# Altium schematic sheet audio.schdoc
size A3
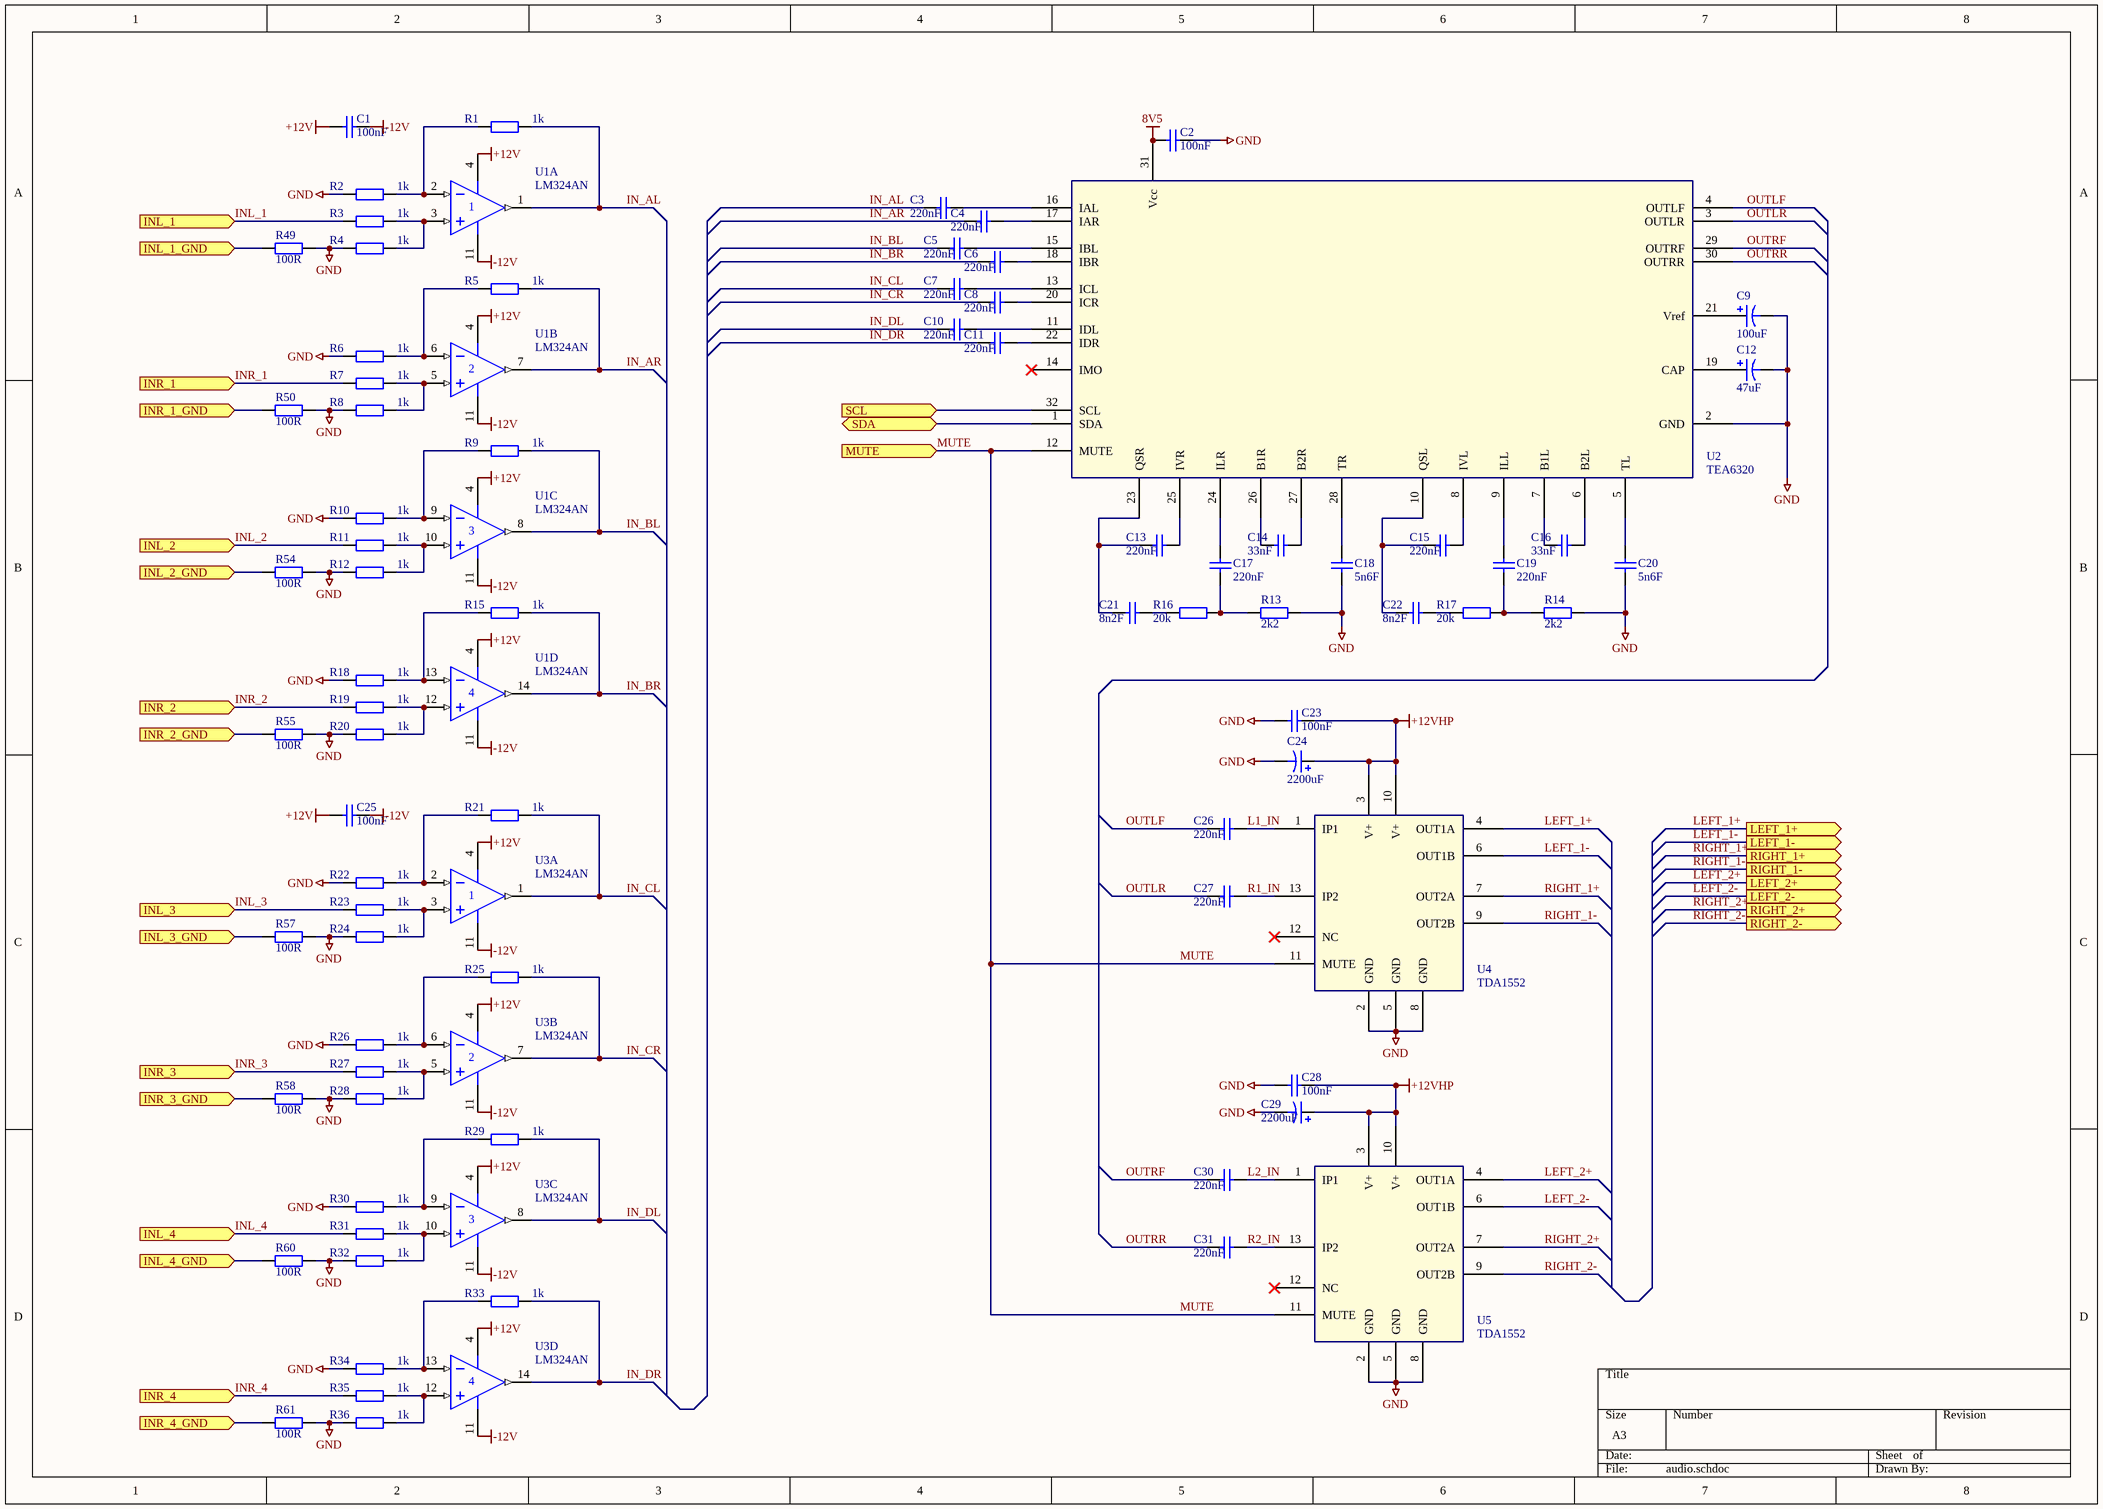
[diagram p0: audio.schdoc]

## Parts
C1  100nF  [CAP (3D) - 0603]
C2  100nF  [CAP (3D) - 0603]
C3  220nF  [CAP (3D) - 0603]
C4  220nF  [CAP (3D) - 0603]
C5  220nF  [CAP (3D) - 0603]
C6  220nF  [CAP (3D) - 0603]
C7  220nF  [CAP (3D) - 0603]
C8  220nF  [CAP (3D) - 0603]
C9  100uF  [CAPPR5-5x5]
C10  220nF  [CAP (3D) - 0603]
C11  220nF  [CAP (3D) - 0603]
C12  47uF  [CAPPR5-5x5]
C13  220nF  [CAP (3D) - 0603]
C14  33nF  [CAP (3D) - 0603]
C15  220nF  [CAP (3D) - 0603]
C16  33nF  [CAP (3D) - 0603]
C17  220nF  [CAP (3D) - 0603]
C18  5n6F  [CAP (3D) - 0603]
C19  220nF  [CAP (3D) - 0603]
C20  5n6F  [CAP (3D) - 0603]
C21  8n2F  [CAP (3D) - 0603]
C22  8n2F  [CAP (3D) - 0603]
C23  100nF  [CAP (3D) - 0603]
C24  2200uF  [CAPPR7.5-16x35]
C25  100nF  [CAP (3D) - 0603]
C26  220nF  [CAP (3D) - 0603]
C27  220nF  [CAP (3D) - 0603]
C28  100nF  [CAP (3D) - 0603]
C29  2200uF  [CAPPR7.5-16x35]
C30  220nF  [CAP (3D) - 0603]
C31  220nF  [CAP (3D) - 0603]
R1  1k  [RES (3D) - 0603]
R2  1k  [RES (3D) - 0603]
R3  1k  [RES (3D) - 0603]
R4  1k  [RES (3D) - 0603]
R5  1k  [RES (3D) - 0603]
R6  1k  [RES (3D) - 0603]
R7  1k  [RES (3D) - 0603]
R8  1k  [RES (3D) - 0603]
R9  1k  [RES (3D) - 0603]
R10  1k  [RES (3D) - 0603]
R11  1k  [RES (3D) - 0603]
R12  1k  [RES (3D) - 0603]
R13  2k2  [RES (3D) - 0603]
R14  2k2  [RES (3D) - 0603]
R15  1k  [RES (3D) - 0603]
R16  20k  [RES (3D) - 0603]
R17  20k  [RES (3D) - 0603]
R18  1k  [RES (3D) - 0603]
R19  1k  [RES (3D) - 0603]
R20  1k  [RES (3D) - 0603]
R21  1k  [RES (3D) - 0603]
R22  1k  [RES (3D) - 0603]
R23  1k  [RES (3D) - 0603]
R24  1k  [RES (3D) - 0603]
R25  1k  [RES (3D) - 0603]
R26  1k  [RES (3D) - 0603]
R27  1k  [RES (3D) - 0603]
R28  1k  [RES (3D) - 0603]
R29  1k  [RES (3D) - 0603]
R30  1k  [RES (3D) - 0603]
R31  1k  [RES (3D) - 0603]
R32  1k  [RES (3D) - 0603]
R33  1k  [RES (3D) - 0603]
R34  1k  [RES (3D) - 0603]
R35  1k  [RES (3D) - 0603]
R36  1k  [RES (3D) - 0603]
R49  100R  [RES (3D) - 0603]
R50  100R  [RES (3D) - 0603]
R54  100R  [RES (3D) - 0603]
R55  100R  [RES (3D) - 0603]
R57  100R  [RES (3D) - 0603]
R58  100R  [RES (3D) - 0603]
R60  100R  [RES (3D) - 0603]
R61  100R  [RES (3D) - 0603]
U1  LM324AN  [N014]  (parts A,B,C,D of 4)
U2  TEA6320  [SOIC127P1047-32L]
U3  LM324AN  [N014]  (parts A,B,C,D of 4)
U4  TDA1552  [DBS13P]
U5  TDA1552  [DBS13P]

## Ports
INL_1 (in), INL_1_GND (in), INL_2 (in), INL_2_GND (in), INL_3 (in), INL_3_GND (in), INL_4 (in), INL_4_GND (in), INR_1 (in), INR_1_GND (in), INR_2 (in), INR_2_GND (in), INR_3 (in), INR_3_GND (in), INR_4 (in), INR_4_GND (in), LEFT_1+ (out), LEFT_1- (out), LEFT_2+ (out), LEFT_2- (out), MUTE (in), RIGHT_1+ (out), RIGHT_1- (out), RIGHT_2+ (out), RIGHT_2- (out), SCL (in), SDA (bidir)

## Nets
8V5: C2.1 U2.31(Vcc)
+12V: C1.1 C25.1 U1.4(V+) U3.4(V+)
+12VHP: C23.2 C24.1 C28.2 C29.1 U4.3(V+) U4.10(V+) U5.3(V+) U5.10(V+)
-12V: C1.2 C25.2 U1.11(V-) U3.11(V-)
GND: C2.2 C9.2 C12.2 C18.2 C20.2 C23.1 C24.2 C28.1 C29.2 R2.1 R4.1 R6.1 R8.1 R10.1 R12.1 R13.2 R14.2 R18.1 R20.1 R22.1 R24.1 R26.1 R28.1 R30.1 R32.1 R34.1 R36.1 R49.2 R50.2 R54.2 R55.2 R57.2 R58.2 R60.2 R61.2 U2.2(GND) U4.2(GND) U4.5(GND) U4.8(GND) U5.2(GND) U5.5(GND) U5.8(GND)
IN_AL: C3.1 R1.2 U1.1(OUT)
IN_AR: C4.1 R5.2 U1.7(OUT)
IN_BL: C5.1 R9.2 U1.8(OUT)
IN_BR: C6.1 R15.2 U1.14(OUT)
IN_CL: C7.1 R21.2 U3.1(OUT)
IN_CR: C8.1 R25.2 U3.7(OUT)
IN_DL: C10.1 R29.2 U3.8(OUT)
IN_DR: C11.1 R33.2 U3.14(OUT)
INL_1: R3.1 ; port INL_1
INL_1_GND: R49.1 ; port INL_1_GND
INL_2: R11.1 ; port INL_2
INL_2_GND: R54.1 ; port INL_2_GND
INL_3: R23.1 ; port INL_3
INL_3_GND: R57.1 ; port INL_3_GND
INL_4: R31.1 ; port INL_4
INL_4_GND: R60.1 ; port INL_4_GND
INR_1: R7.1 ; port INR_1
INR_1_GND: R50.1 ; port INR_1_GND
INR_2: R19.1 ; port INR_2
INR_2_GND: R55.1 ; port INR_2_GND
INR_3: R27.1 ; port INR_3
INR_3_GND: R58.1 ; port INR_3_GND
INR_4: R35.1 ; port INR_4
INR_4_GND: R61.1 ; port INR_4_GND
L1_IN: C26.2 U4.1(IP1)
L2_IN: C30.2 U5.1(IP1)
LEFT_1+: U4.4(OUT1A) ; port LEFT_1+
LEFT_1-: U4.6(OUT1B) ; port LEFT_1-
LEFT_2+: U5.4(OUT1A) ; port LEFT_2+
LEFT_2-: U5.6(OUT1B) ; port LEFT_2-
MUTE: U2.12(MUTE) U4.11(MUTE) U5.11(MUTE) ; port MUTE
OUTLF: C26.1 U2.4(OUTLF)
OUTLR: C27.1 U2.3(OUTLR)
OUTRF: C30.1 U2.29(OUTRF)
OUTRR: C31.1 U2.30(OUTRR)
R1_IN: C27.2 U4.13(IP2)
R2_IN: C31.2 U5.13(IP2)
RIGHT_1+: U4.7(OUT2A) ; port RIGHT_1+
RIGHT_1-: U4.9(OUT2B) ; port RIGHT_1-
RIGHT_2+: U5.7(OUT2A) ; port RIGHT_2+
RIGHT_2-: U5.9(OUT2B) ; port RIGHT_2-
SCL: U2.32(SCL) ; port SCL
SDA: U2.1(SDA) ; port SDA
NetC3_2: C3.2 U2.16(IAL)
NetC4_2: C4.2 U2.17(IAR)
NetC5_2: C5.2 U2.15(IBL)
NetC6_2: C6.2 U2.18(IBR)
NetC7_2: C7.2 U2.13(ICL)
NetC8_2: C8.2 U2.20(ICR)
NetC9_1: C9.1 U2.21(Vref)
NetC10_2: C10.2 U2.11(IDL)
NetC11_2: C11.2 U2.22(IDR)
NetC12_1: C12.1 U2.19(CAP)
NetC13_1: C13.1 C21.1 U2.23(QSR)
NetC13_2: C13.2 U2.25(IVR)
NetC14_1: C14.1 U2.26(B1R)
NetC14_2: C14.2 U2.27(B2R)
NetC15_1: C15.1 C22.1 U2.10(QSL)
NetC15_2: C15.2 U2.8(IVL)
NetC16_1: C16.1 U2.7(B1L)
NetC16_2: C16.2 U2.6(B2L)
NetC17_1: C17.1 U2.24(ILR)
NetC17_2: C17.2 R13.1 R16.1
NetC18_1: C18.1 U2.28(TR)
NetC19_1: C19.1 U2.9(ILL)
NetC19_2: C19.2 R14.1 R17.1
NetC20_1: C20.1 U2.5(TL)
NetC21_2: C21.2 R16.2
NetC22_2: C22.2 R17.2
NetR1_1: R1.1 R2.2 U1.2(IN-)
NetR3_2: R3.2 R4.2 U1.3(IN+)
NetR5_1: R5.1 R6.2 U1.6(IN-)
NetR7_2: R7.2 R8.2 U1.5(IN+)
NetR9_1: R9.1 R10.2 U1.9(IN-)
NetR11_2: R11.2 R12.2 U1.10(IN+)
NetR15_1: R15.1 R18.2 U1.13(IN-)
NetR19_2: R19.2 R20.2 U1.12(IN+)
NetR21_1: R21.1 R22.2 U3.2(IN-)
NetR23_2: R23.2 R24.2 U3.3(IN+)
NetR25_1: R25.1 R26.2 U3.6(IN-)
NetR27_2: R27.2 R28.2 U3.5(IN+)
NetR29_1: R29.1 R30.2 U3.9(IN-)
NetR31_2: R31.2 R32.2 U3.10(IN+)
NetR33_1: R33.1 R34.2 U3.13(IN-)
NetR35_2: R35.2 R36.2 U3.12(IN+)

Not connected (* = marked no-connect by the designer): U2 14(IMO)*; U4 12(NC)*; U5 12(NC)*

## Library data of the parts
C1 C2 C23 C25 C28 = Cap: Capacitor; Manufacturer: YAEGO; Manufacturer Part No.: CC0603ZRY5V9BB104; Value: 100nF; Mouser Part no.: 603-C0603ZRY5V9BB104; Web link: http://au.mouser.com/ProductDetail/Yageo/CC0603ZRY5V9BB104/?qs=AgBp2OyFlx%252bk1xe0tOfw5lSGBXIDidlPHbEeepmuVSw%3d; Supplier 1: Mouser; Supplier Part Number 1: 603-C0603ZRY5V9BB104; Supplier 2: Digi-Key; Supplier Part Number 2: 311-1343-2-ND
C3-C8 C10 C11 C13 C15 C17 C19 C26 C27 C30 C31 = Cap: Capacitor; Manufacturer: YAGEO; Manufacturer Part No.: CC0603KRX7R6BB224; Value: 220nF; Mouser Part no.: 603-CC603KRX7R6BB224; Web link: http://au.mouser.com/ProductDetail/Yageo/CC0603KRX7R6BB224/?qs=AgBp2OyFlx832aJNQIgpgiHcXe6SP9wJA8622nI5Qdc%3d; Supplier 1: Mouser; Supplier 2: Digi-Key; Supplier Part Number 1: 810-C1608X7R1E224K; Supplier Part Number 2: 445-5191-1-ND
C9 = Cap Pol1: Polarized Capacitor (Radial); Manufacturer: EPCOS; Manufacturer Part No.: B41828A7107M7; Value: 100uF; Mouser Part No.: 871-B41828A7107M7; Web Link: http://au.mouser.com/ProductDetail/EPCOS/B41828A7107M7/?qs=nVvxX1UUhUykfM7qFE3BRbEQLHdHrVYrVo8dT3SN8Ro%3d; Supplier 1: Mouser; Supplier Part Number 1: 667-EEU-FR1E101; Supplier 2: Digi-Key; Supplier Part Number 2: P5152-ND
C12 = Cap Pol1: Polarized Capacitor (Radial); Manufacturer: EPCOS; Manufacturer Part No.: B41821A7476M000; Value: 47uF; Mouser Part No.: 871-B41821A7476M000; Web Link: http://au.mouser.com/ProductDetail/EPCOS/B41821A7476M000/?qs=DFkWJ3l%252bHdIv7z5oK21FR7vsdrlTw8IhmVcyMZVp3lA%3d; Supplier 1: Mouser; Supplier Part Number 1: 667-EEU-FR1E470; Supplier 2: Digi-Key; Supplier Part Number 2: P15360CT-ND
C14 C16 = Cap: Capacitor; Manufacturer: VISHAY; Manufacturer Part No.: VJ0603Y333KXACW1BC; Value: 33nF; Mouser Part No.: 77-VJ0603Y333KXACBC; Web Link: http://au.mouser.com/ProductDetail/Vishay-Vitramon/VJ0603Y333KXACW1BC/?qs=luzi6J3HciVz2jbLrp0fISmEIlUx13SmksE8B%2fo8iFo%3d; Supplier 1: Mouser; Supplier Part Number 1: 810-CGJ3E2X7R1C333K; Supplier 2: Digi-Key; Supplier Part Number 2: 445-5093-1-ND
C18 C20 = Cap: Capacitor; Manufacturer: YAEGO; Manufacturer Part No.: CC0603KRX7R9BB562; Value: 5n6F; Mouser Part No.: 603-CC603KRX7R9BB562; Web Link: http://au.mouser.com/ProductDetail/Yageo/CC0603KRX7R9BB562/?qs=AgBp2OyFlx%2fpnRyz2d1BOV0w2oSYtKHWEBmm9y5urok%3d; Supplier 1: Mouser; Supplier Part Number 1: 77-VJ0603Y562KXAPBC; Supplier 2: Digi-Key; Supplier Part Number 2: 445-2666-1-ND
C21 C22 = Cap: Capacitor; Manufacturer: VISHAY; Manufacturer Part No.: VJ0603Y822KXACW1BC; Value: 8n2F; Mouser Part No.: 77-VJ0603Y822KXACBC; Web Link: http://au.mouser.com/ProductDetail/Vishay-Vitramon/VJ0603Y822KXACW1BC/?qs=ZwrkFVw2o8%2ft%252b373yGtNl93PhR3QyA%252bD6uaH33kGuhU%3d; Supplier 1: Mouser; Supplier 2: Digi-Key; Supplier Part Number 1: 81-GRM18R71E822KA01D; Supplier Part Number 2: 445-2668-6-ND
C24 C29 = Cap Pol1: Polarized Capacitor (Radial); Manufacturer: Lelon; Manufacturer Part No.: RGA222M1EBK-1625P; Value: 2200uF; Mouser Part No.: 140-RGA222M1EBK1625P; Web Link: http://au.mouser.com/ProductDetail/Lelon/RGA222M1EBK-1625P/?qs=LVGG2qFPDbHSw2xJTgLljXX%252bpY7%2f7oyC%252beiZpKBfNsE%3d; Supplier 1: Mouser; Supplier 2: Digi-Key; Supplier Part Number 1: 80-ESK228M025AL4AA; Supplier Part Number 2: 399-6110-ND
R1-R12 R15 R18-R36 = Res2: Resistor; Manufacturer: YAEGO; Manufacturer Part No.: AC0603FR-071KL; Value: 1k; Mouser Part No.: 603-AC0603FR-071KL; Web Link: http://au.mouser.com/ProductDetail/Yageo/AC0603FR-071KL/?qs=UoPT7wUmgYKxwZ%2f8fbV6CGhBt%252bA%252b5EDe; Supplier 1: Mouser; Supplier 2: Digi-Key; Supplier Part Number 1: 603-AC0603FR-071KL; Supplier Part Number 2: 311-1KLDCT-ND
R13 R14 = Res2: Resistor; Manufacturer: YAEGO; Manufacturer Part No.: RC0603JR-072K2L; Value: 2k2; Mouser Part No.: 603-RC0603JR-072K2L; Web Link: http://au.mouser.com/ProductDetail/Yageo/RC0603JR-072K2L/?qs=%2f9ZTgpVJnN6NiG8%2fhy1UYdm%2fIZ4uAodTTlsfuu9%2fRBA%3d; Supplier 1: Mouser; Supplier 2: Digi-Key; Supplier Part Number 1: 71-CRCW0603J-2.2K-E3; Supplier Part Number 2: RMCF0603JT2K20CT-ND
R16 R17 = Res2: Resistor; Manufacturer: XICON; Manufacturer Part No.: 302-20K-RC; Value: 20k; Mouser Part No.: 302-20K-RC; Web Link: http://au.mouser.com/ProductDetail/Xicon/302-20K-RC/?qs=QiHmIYCRcHpC334pZQQGxw1aK3emtO7wZTvJ4LdbZl8%3d; Supplier 1: Mouser; Supplier 2: Digi-Key; Supplier Part Number 1: 652-CR0603JW-203ELF; Supplier Part Number 2: P20KGCT-ND
R49 R50 R54 R55 R57 R58 R60 R61 = Res2: Resistor; Manufacturer: YAEGO; Manufacturer Part No.: RC0603FR-07100RL; Value: 100R; Mouser Part No.: 603-RC0603FR-07100RL; Web Link: http://au.mouser.com/ProductDetail/Yageo/RC0603FR-07100RL/?qs=NEN%2fsE%2fLsvNZmJsqhL3QSPml4gnL9OhHteu5IxNdzn8%3d; Supplier 1: Mouser; Supplier Part Number 1: 302-100-RC; Supplier 2: Digi-Key; Supplier Part Number 2: RMCF0603JT100RCT-ND
U1 U3 = LM324AN: Quadruple Operational Amplifier; Manufacturer: ST MICRO; Value: LM324; Manufacturer Part No.: LM324AN; Mouser Part No.: 511-LM324AN; Web Link: http://au.mouser.com/ProductDetail/STMicroelectronics/LM324AN/?qs=Aez0sHNrW%2fUytSAnJAKyV%252b8BIEGXhIFhom0MkRvP3bs%3d; Supplier 1: Mouser; Supplier Part Number 1: 595-LM324AN; Supplier 2: Digi-Key; Supplier Part Number 2: 497-1579-5-ND
U2 = TEA6320: TEA6320 SOUND FADER CONTROL; Manufacturer: NXP SEMICONDUCTOR; Manufacturer Part No.: TEA6320T/V1,518; Mouser Part No.: 771-TEA6320TD-T; Web Link: http://au.mouser.com/ProductDetail/NXP-Semiconductors/TEA6320T-V1518/?qs=LOCUfHb8d9uVFMOgY9aWifj9j3JlMzQOD29BrXWviGU%3d; Value: TEA6320
U4 U5 = TDA1552: Manufacturer: NXP SEMICONDUCTOR; Manufacturer Part No.: TDA1552Q/N4,112; Mouser Part No.: 771-TDA1552QU; Web Link: http://au.mouser.com/ProductDetail/NXP/TDA1552Q-N4112/?qs=LOCUfHb8d9vIWlct8ea52g%3d%3d; Value: TDA1552